# EasyEDA Pro project ProProject_20240809-UR5控制板_2024-08-29.epro

# Schematic Schematic1
Create Date: 2024-08-09; Page Name: P1; Project Name: 20240809-UR5控制板; Schematic Name: Schematic1; Update Date: 2024-08-09; Company: 嘉立创EDA; Page Size: A4; Version: V1.0
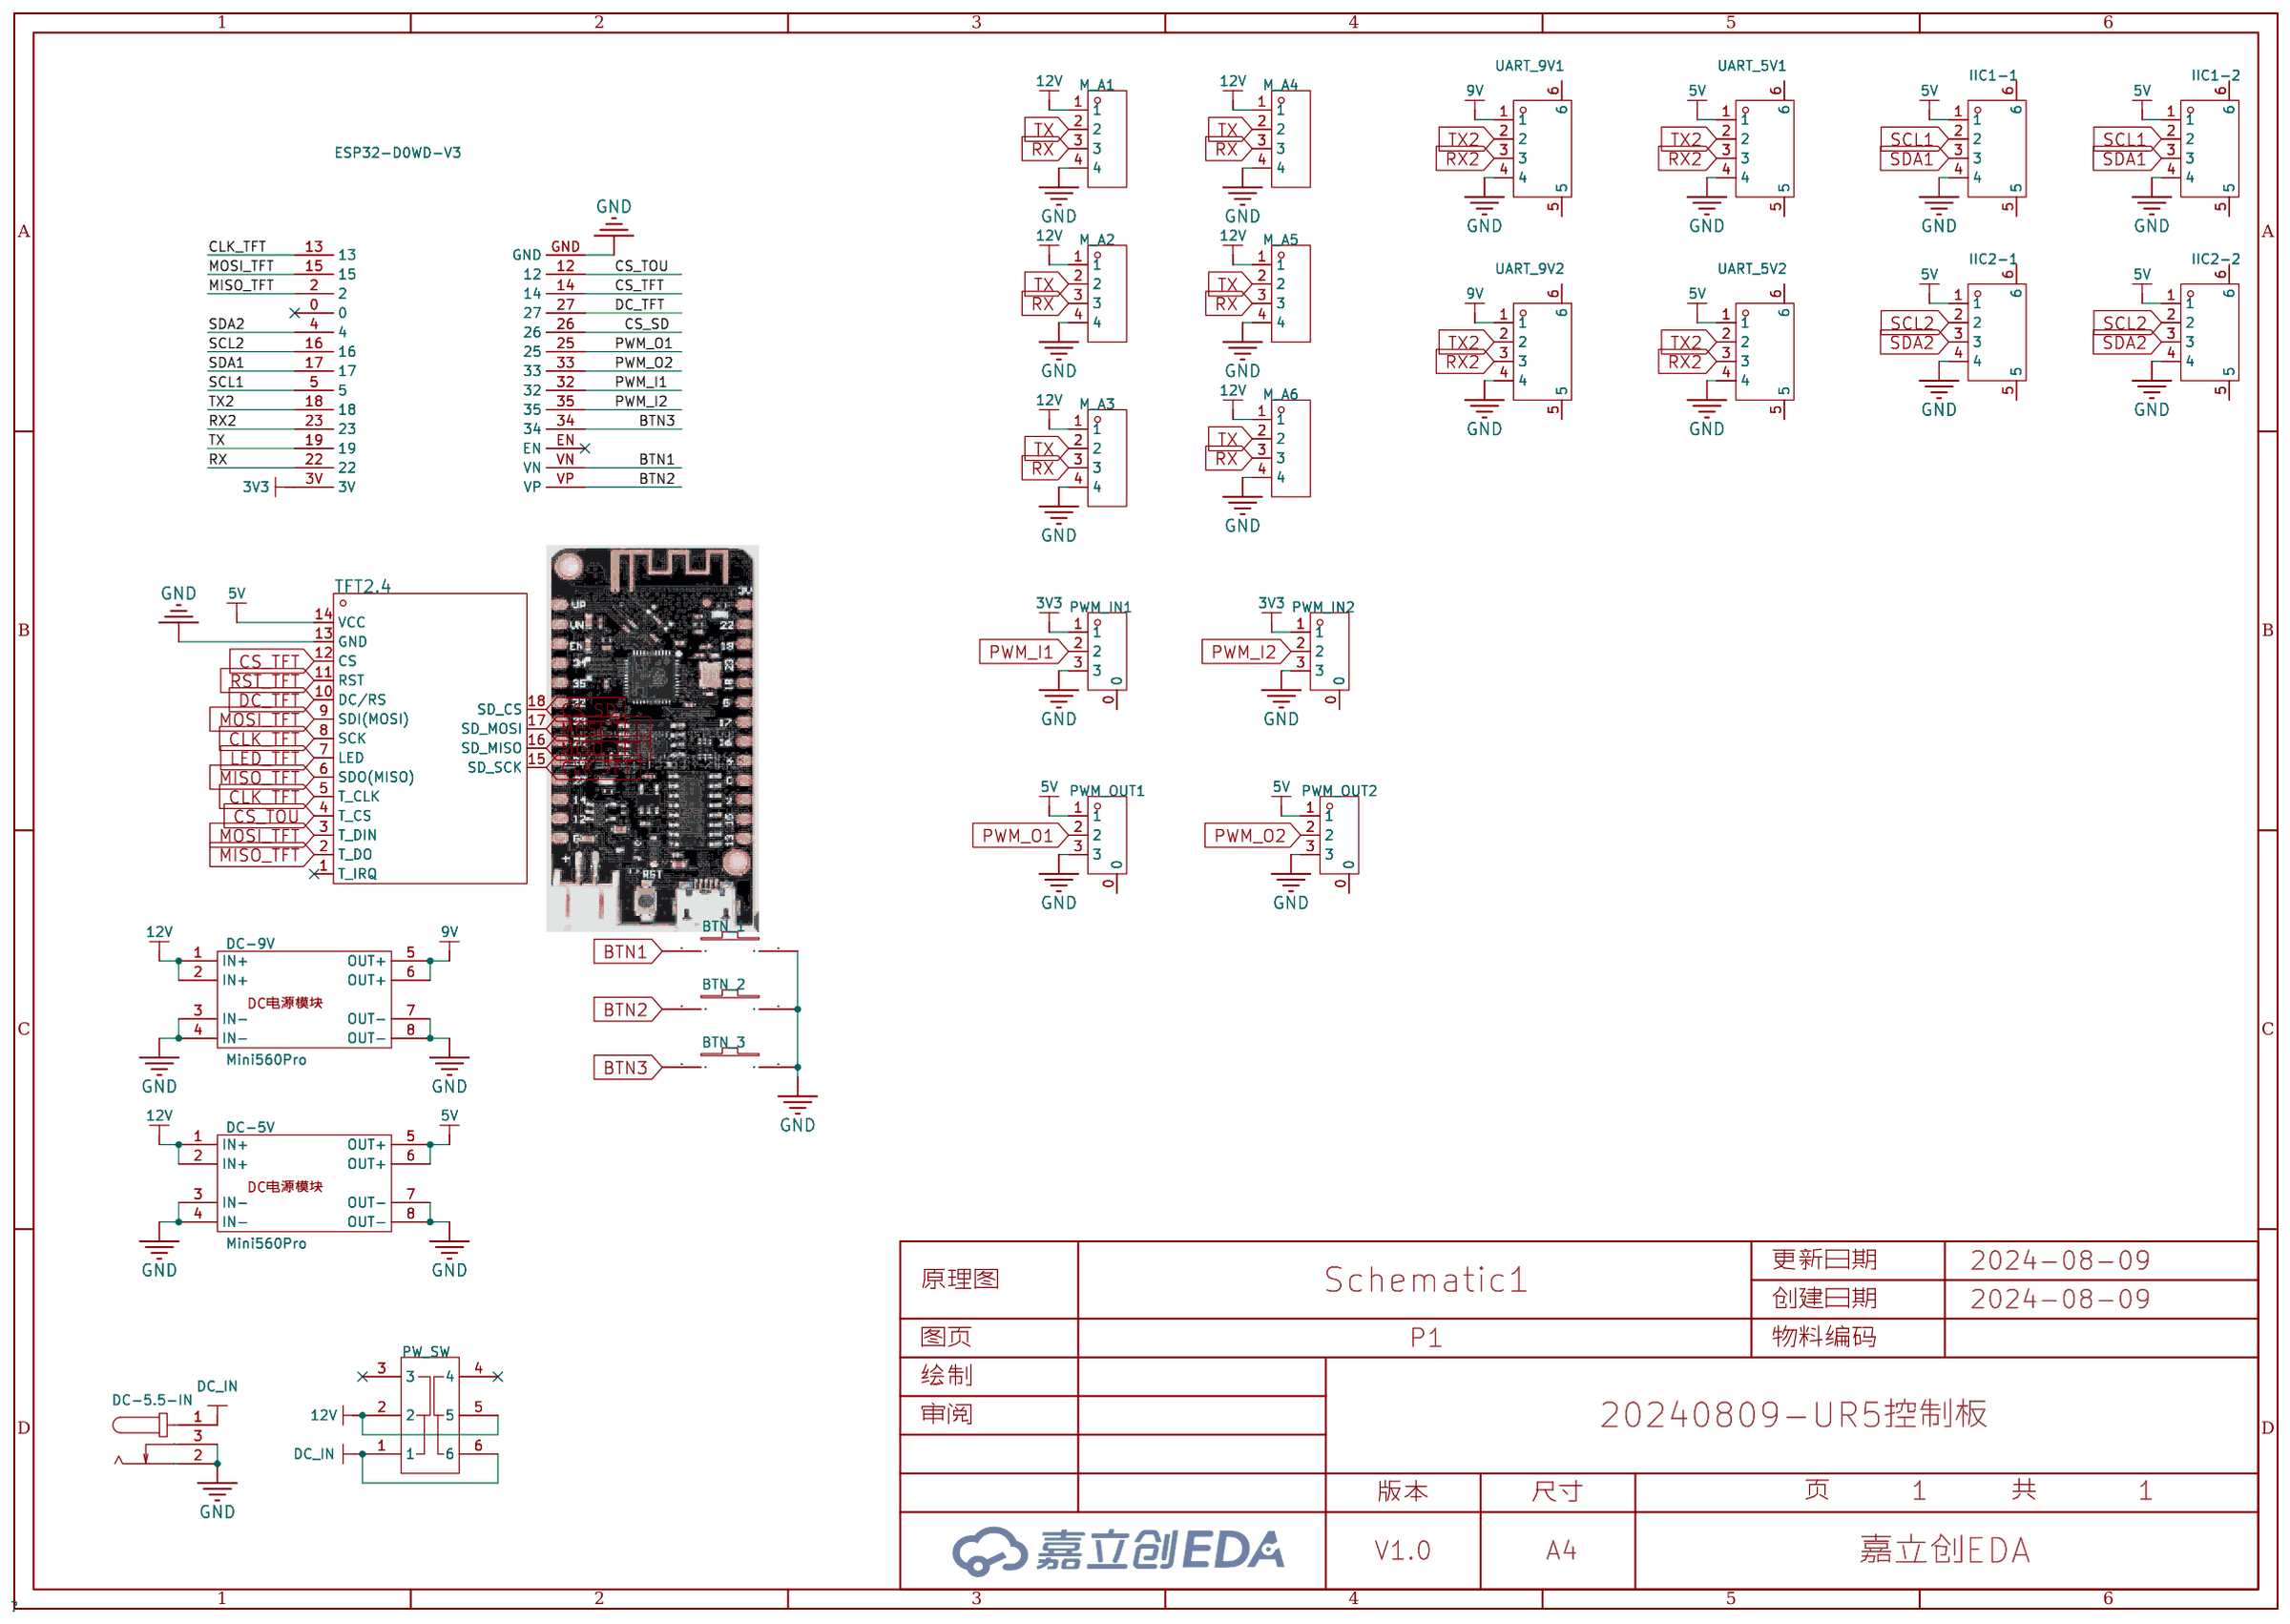
[diagram p0: schematic sheet]

## Parts
BTN_1  K2-1104DZ-B4SW-04  [SW-TH_2P-L6.2-W6.2-P5.0]
BTN_2  K2-1104DZ-B4SW-04  [SW-TH_2P-L6.2-W6.2-P5.0]
BTN_3  K2-1104DZ-B4SW-04  [SW-TH_2P-L6.2-W6.2-P5.0]
DC-5.5-IN  -  [DC母座]
DC-5V  Mini560Pro  [Mini560Pro]
DC-9V  Mini560Pro  [Mini560Pro]
ESP32-D0WD-V3  -  [ESP32]
IIC1-1  ZX-PH2.0-WT4P  [CONN-SMD_4P-P2.00_C2001RS10411M0101RC]
IIC1-2  ZX-PH2.0-WT4P  [CONN-SMD_4P-P2.00_C2001RS10411M0101RC]
IIC2-1  ZX-PH2.0-WT4P  [CONN-SMD_4P-P2.00_C2001RS10411M0101RC]
IIC2-2  ZX-PH2.0-WT4P  [CONN-SMD_4P-P2.00_C2001RS10411M0101RC]
M_A1  ZX-XH2.54-4PWZ  [CONN-TH_4P-P2.50_ZX-XH2.54-4PWZ]
M_A2  ZX-XH2.54-4PWZ  [CONN-TH_4P-P2.50_ZX-XH2.54-4PWZ]
M_A3  ZX-XH2.54-4PWZ  [CONN-TH_4P-P2.50_ZX-XH2.54-4PWZ]
M_A4  ZX-XH2.54-4PWZ  [CONN-TH_4P-P2.50_ZX-XH2.54-4PWZ]
M_A5  ZX-XH2.54-4PWZ  [CONN-TH_4P-P2.50_ZX-XH2.54-4PWZ]
M_A6  ZX-XH2.54-4PWZ  [CONN-TH_4P-P2.50_ZX-XH2.54-4PWZ]
PW_SW  开关-9*3.5  [SK09C G2]
PWM_IN1  SH1.0-3P  [CONN-SMD_3P-P1.00-L5.0-W5.0]
PWM_IN2  SH1.0-3P  [CONN-SMD_3P-P1.00-L5.0-W5.0]
PWM_OUT1  SH1.0-3P  [CONN-SMD_3P-P1.00-L5.0-W5.0]
PWM_OUT2  SH1.0-3P  [CONN-SMD_3P-P1.00-L5.0-W5.0]
TFT2.4  -  [TFT_2.4_18P_SPI_ILI9341_240X320_65K_S_1]
UART_5V1  ZX-PH2.0-WT4P  [CONN-SMD_4P-P2.00_C2001RS10411M0101RC]
UART_5V2  ZX-PH2.0-WT4P  [CONN-SMD_4P-P2.00_C2001RS10411M0101RC]
UART_9V1  ZX-PH2.0-WT4P  [CONN-SMD_4P-P2.00_C2001RS10411M0101RC]
UART_9V2  ZX-PH2.0-WT4P  [CONN-SMD_4P-P2.00_C2001RS10411M0101RC]

## Library data of the parts
BTN_1-BTN_3 = K2-1104DZ-B4SW-04: 作用力:250gf;安装方式:直插;开关长度:6mm;开关宽度:6mm;开关高度:4.5mm;触点电流:50mA;额定电压(DC):12V;绝缘电阻:100MΩ;机械寿命:10万次;; LCSC Part Name: 6x6x4.5  两脚插件开关; Supplier Part: C2690025; Manufacturer: 韩国韩荣; Supplier Footprint: 插件; JLCPCB Part Class: 扩展库; Datasheet: https://atta.szlcsc.com/upload/public/pdf/source/20201126/C961736_4F85C6E6E5B3656D5DC7C0B00D034F4A.pdf; Supplier: LCSC; Operating Force: 250gf; Mounting Style: 直插; Switch Length: 6mm; Switch Width: 6mm; Switch Height: 4.5mm; Contact Current: 50mA; Voltage Rating (DC): 12V; Insulation Resistance: 100MΩ; Mechanical Life: 10万次; Operating Temperature: -25℃~+85℃
DC-5.5-IN = DC母座
DC-5V DC-9V = Mini560Pro: DC电源模块; 购买链接: https://detail.tmall.com/item.htm?abbucket=10id=726771436106ns=1spm=a21n57.1.0.0.255a523cj9lO4QskuId=5046144793559
ESP32-D0WD-V3 = ESP32
IIC1-1 IIC1-2 IIC2-1 IIC2-2 UART_5V1 UART_5V2 UART_9V1 UART_9V2 = ZX-PH2.0-WT4P: 插针结构:1x4P;间距:2mm;安装方式:卧贴;参考系列:PH;总PIN数:4P;排数:1;每排PIN数:4;行距:-;额定电流:2A;触头材质:黄铜;触头镀层:锡;工作温度范围:-25℃~+85℃;; Supplier Part: C7429691; Manufacturer: Megastar(兆星); Supplier Footprint: SMD,P=2mm,卧贴; JLCPCB Part Class: 扩展库; Datasheet: https://atta.szlcsc.com/upload/public/pdf/source/20230619/C513FA7515D7082C4F95173A4D7F5060.pdf; Supplier: LCSC; Pins Structure: 1x4P; Pitch: 2mm; Mounting Style: 卧贴; Reference Series: PH; Number of Pins: 4P; Number of Rows: 1; Number of PINs Per Row: 4; Current Rating (Max): 2A; Contact Material: 黄铜; Contact Plating: 锡; Operating Temperature Range: -25℃~+85℃
M_A1-M_A6 = ZX-XH2.54-4PWZ: 插针结构:1x4P;间距:2.54mm;安装方式:弯插;参考系列:XH;总PIN数:4P;排数:1;每排PIN数:4;行距:-;额定电流:3A;触头材质:黄铜;触头镀层:锡;工作温度范围:-25℃~+85℃;; Supplier Part: C7429643; Manufacturer: Megastar(兆星); Supplier Footprint: 弯插,P=2.54mm; JLCPCB Part Class: 扩展库; Datasheet: https://atta.szlcsc.com/upload/public/pdf/source/20230619/8DC602C7BA46C153FF1BE89D90453879.pdf; Supplier: LCSC; Pins Structure: 1x4P; Pitch: 2.54mm; Mounting Style: 弯插; Reference Series: XH; Number of Pins: 4P; Number of Rows: 1; Number of PINs Per Row: 4; Current Rating (Max): 3A; Contact Material: 黄铜; Contact Plating: 锡; Operating Temperature Range: -25℃~+85℃
PW_SW = SK09C G2
PWM_IN1 PWM_IN2 PWM_OUT1 PWM_OUT2 = SH1.0-3P: Supplier Part: C9900019066; JLCPCB Part Class: 扩展库; Supplier: LCSC
TFT2.4 = TFT_2.4_18P_SPI_ILI9341_240X320_65K_S_1: 2.4寸SPI串口液晶屏TFT彩屏ILI9341驱动; _: 3

## Nets
3V3: ESP32-D0WD-V3.3V PWM_IN1.1 PWM_IN2.1
5V: DC-5V.5(OUT+) DC-5V.6(OUT+) IIC1-1.1 IIC1-2.1 IIC2-1.1 IIC2-2.1 PWM_OUT1.1 PWM_OUT2.1 TFT2.4.14(VCC) UART_5V1.1 UART_5V2.1
9V: DC-9V.5(OUT+) DC-9V.6(OUT+) UART_9V1.1 UART_9V2.1
12V: DC-5V.1(IN+) DC-5V.2(IN+) DC-9V.1(IN+) DC-9V.2(IN+) M_A1.1 M_A2.1 M_A3.1 M_A4.1 M_A5.1 M_A6.1 PW_SW.2 PW_SW.5
GND: BTN_1.2 BTN_2.2 BTN_3.2 DC-5.5-IN.2 DC-5.5-IN.3 DC-5V.3(IN-) DC-5V.4(IN-) DC-5V.7(OUT-) DC-5V.8(OUT-) DC-9V.3(IN-) DC-9V.4(IN-) DC-9V.7(OUT-) DC-9V.8(OUT-) ESP32-D0WD-V3.GND IIC1-1.4 IIC1-2.4 IIC2-1.4 IIC2-2.4 M_A1.4 M_A2.4 M_A3.4 M_A4.4 M_A5.4 M_A6.4 PWM_IN1.3 PWM_IN2.3 PWM_OUT1.3 PWM_OUT2.3 TFT2.4.13(GND) UART_5V1.4 UART_5V2.4 UART_9V1.4 UART_9V2.4
BTN1: BTN_1.1 ESP32-D0WD-V3.VN
BTN2: BTN_2.1 ESP32-D0WD-V3.VP
BTN3: BTN_3.1 ESP32-D0WD-V3.34
CLK_TFT: ESP32-D0WD-V3.13 TFT2.4.5(T_CLK) TFT2.4.8(SCK) TFT2.4.15(SD_SCK)
CS_SD: ESP32-D0WD-V3.26 TFT2.4.18(SD_CS)
CS_TFT: ESP32-D0WD-V3.14 TFT2.4.12(CS)
CS_TOU: ESP32-D0WD-V3.12 TFT2.4.4(T_CS)
DC_IN: DC-5.5-IN.1 PW_SW.1 PW_SW.6
DC_TFT: ESP32-D0WD-V3.27 TFT2.4.10(DC/RS)
LED_TFT: TFT2.4.7(LED)
MISO_TFT: ESP32-D0WD-V3.2 TFT2.4.2(T_DO) TFT2.4.6(SDO(MISO)) TFT2.4.16(SD_MISO)
MOSI_TFT: ESP32-D0WD-V3.15 TFT2.4.3(T_DIN) TFT2.4.9(SDI(MOSI)) TFT2.4.17(SD_MOSI)
PWM_I1: ESP32-D0WD-V3.32 PWM_IN1.2
PWM_I2: ESP32-D0WD-V3.35 PWM_IN2.2
PWM_O1: ESP32-D0WD-V3.25 PWM_OUT1.2
PWM_O2: ESP32-D0WD-V3.33 PWM_OUT2.2
RST_TFT: TFT2.4.11(RST)
RX: ESP32-D0WD-V3.22 M_A1.3 M_A2.3 M_A3.3 M_A4.3 M_A5.3 M_A6.3
RX2: ESP32-D0WD-V3.23 UART_5V1.3 UART_5V2.3 UART_9V1.3 UART_9V2.3
SCL1: ESP32-D0WD-V3.5 IIC1-1.2 IIC1-2.2
SCL2: ESP32-D0WD-V3.16 IIC2-1.2 IIC2-2.2
SDA1: ESP32-D0WD-V3.17 IIC1-1.3 IIC1-2.3
SDA2: ESP32-D0WD-V3.4 IIC2-1.3 IIC2-2.3
TX: ESP32-D0WD-V3.19 M_A1.2 M_A2.2 M_A3.2 M_A4.2 M_A5.2 M_A6.2
TX2: ESP32-D0WD-V3.18 UART_5V1.2 UART_5V2.2 UART_9V1.2 UART_9V2.2

Not connected (* = marked no-connect by the designer): ESP32-D0WD-V3 0* EN*; IIC1-1 5 6; IIC1-2 5 6; IIC2-1 5 6; IIC2-2 5 6; PW_SW 3* 4*; PWM_IN1 0; PWM_IN2 0; PWM_OUT1 0; PWM_OUT2 0; TFT2.4 1(T_IRQ)*; UART_5V1 5 6; UART_5V2 5 6; UART_9V1 5 6; UART_9V2 5 6

# Board PCB1
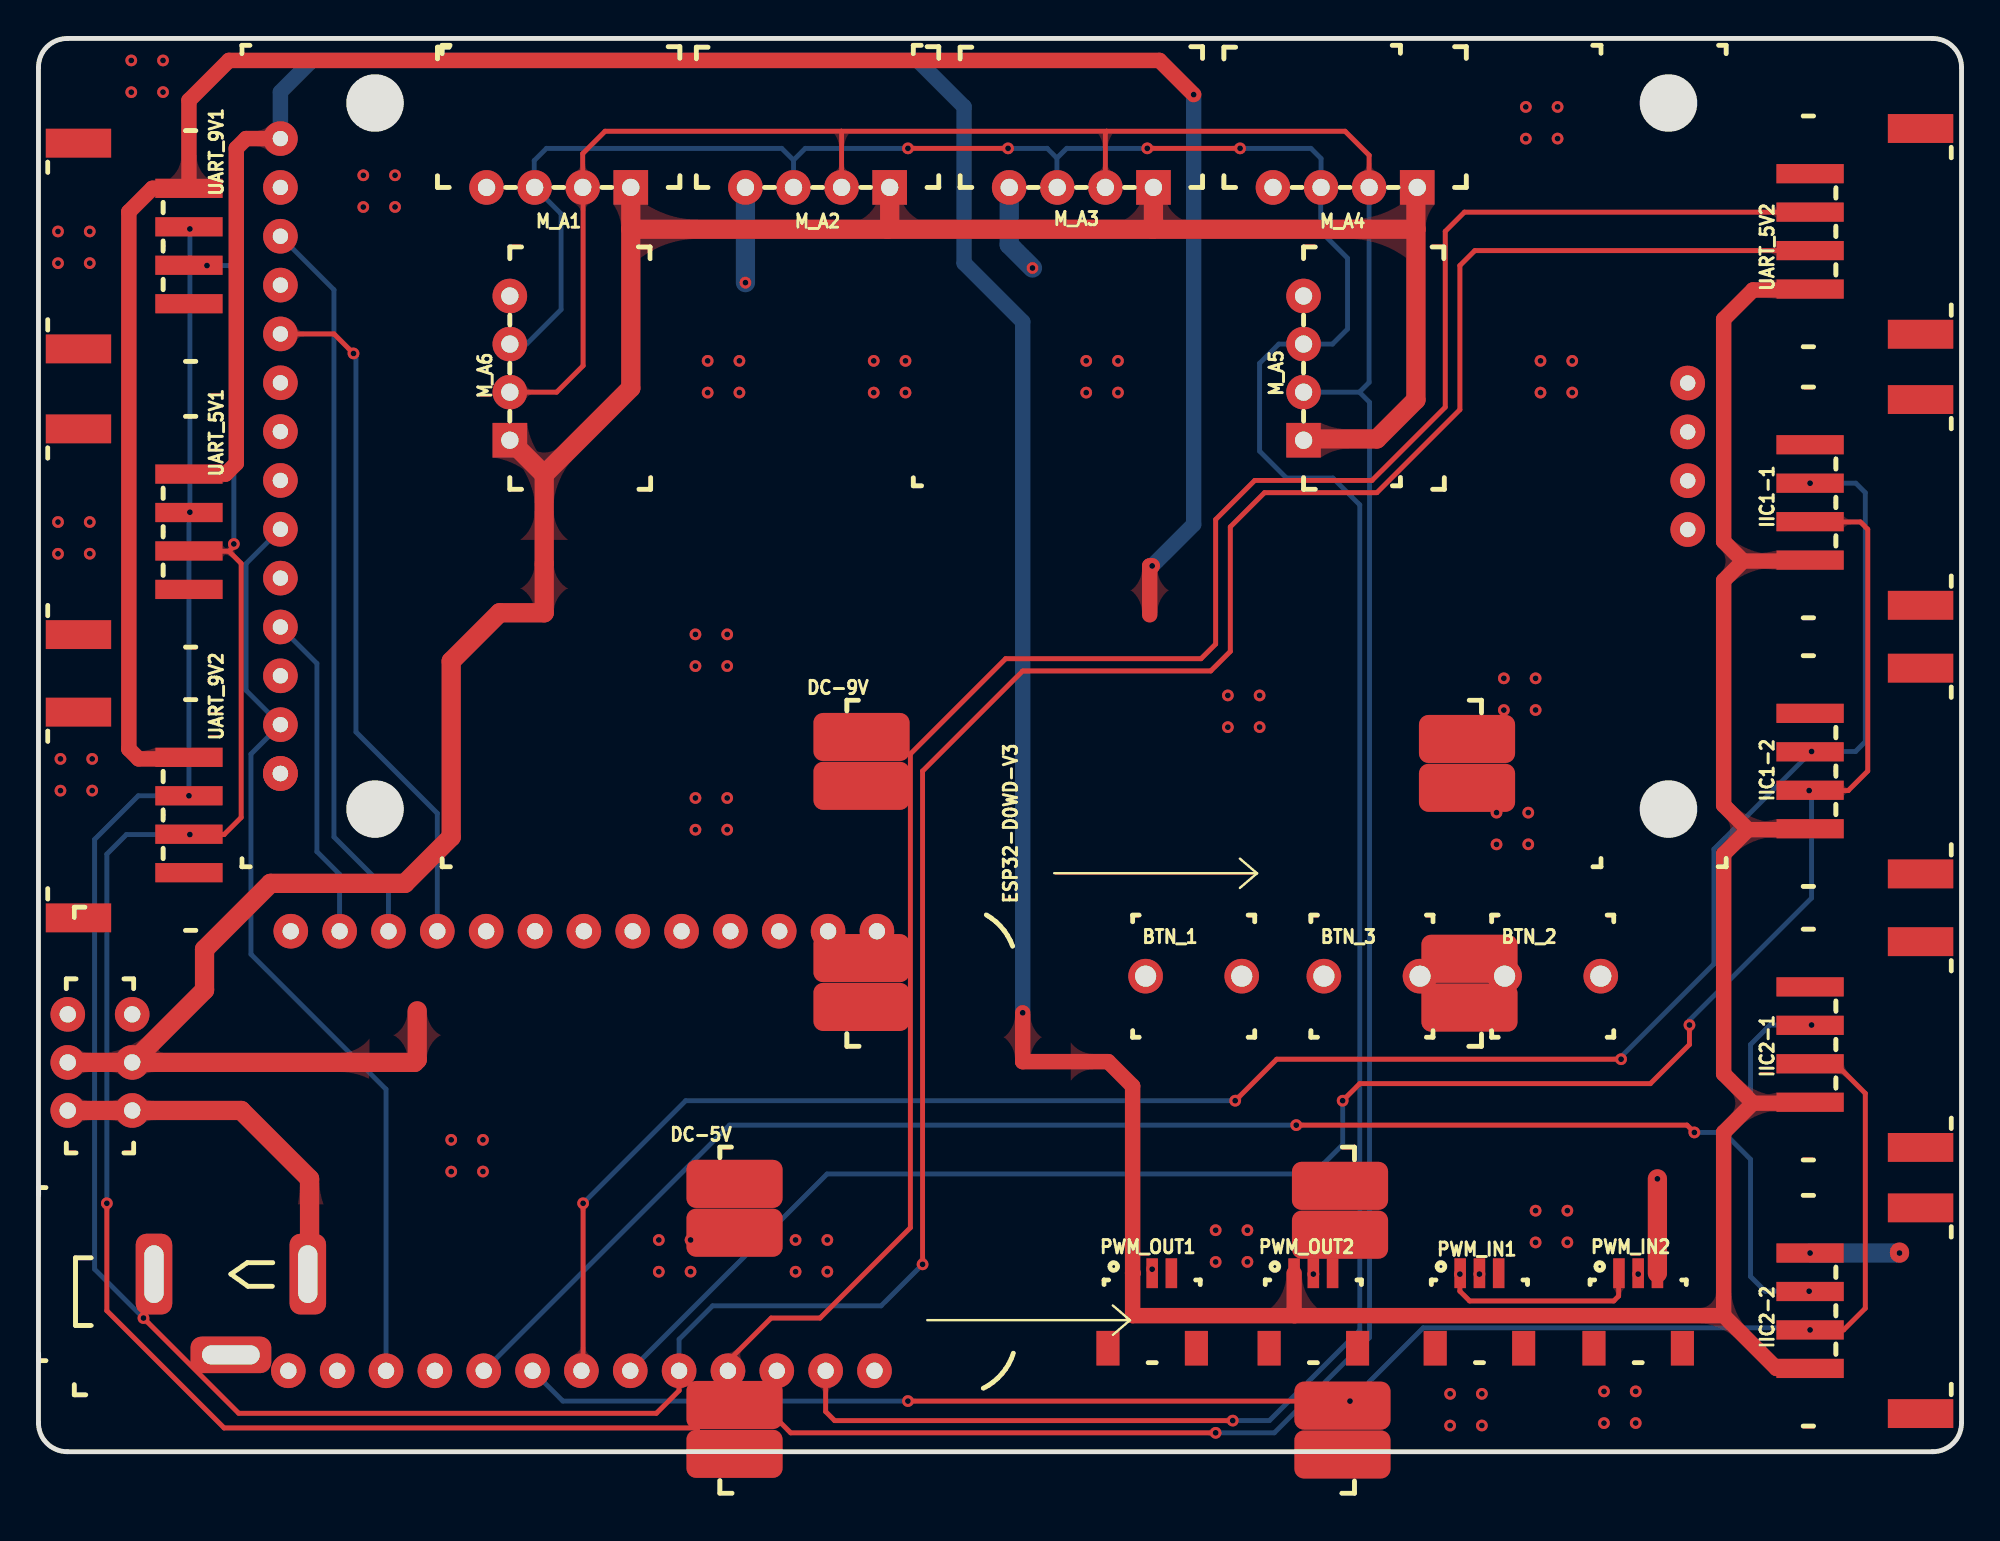
[diagram p1: board, top side]
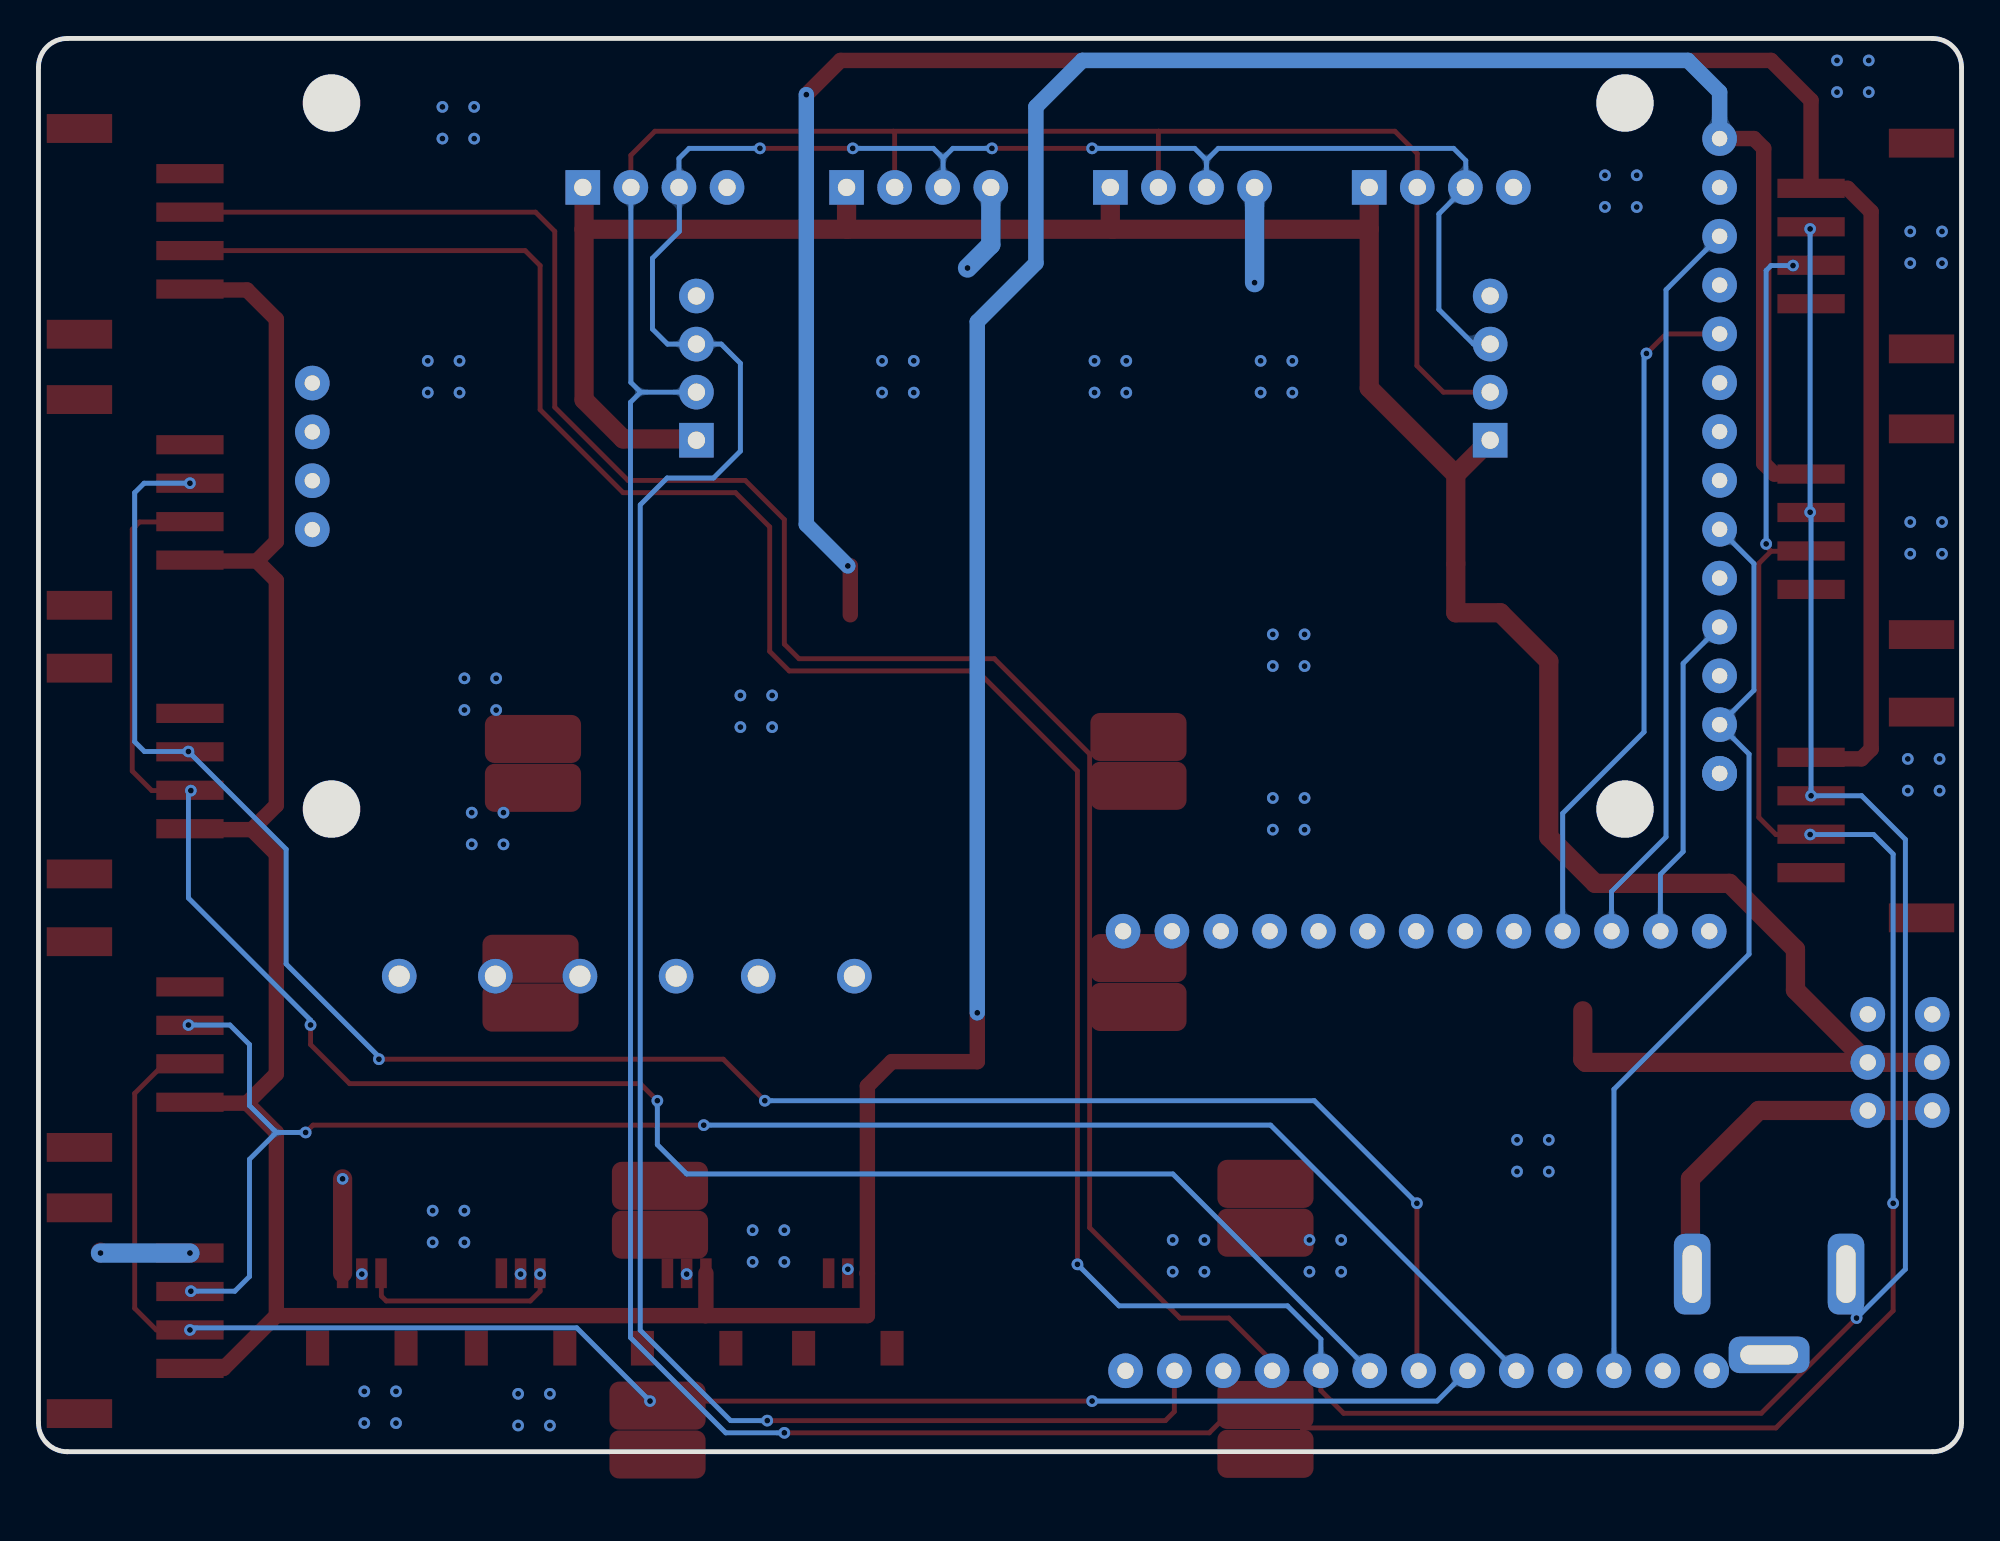
[diagram p2: board, bottom side, seen from below]

Outline 100 x 73.5 mm; copper layers: Top Layer, Inner1, Inner2, Bottom Layer. Coordinates in mm from the lower left corner of the outline.
Outline path: 0,72 0,1.5 arc(0.44,0.44) 1.5,0 98.5,0 arc(99.56,0.44) 100,1.5 100,72 arc(99.56,73.06) 98.5,73.5 1.5,73.5 arc(0.44,73.06) 0,72
Stack: Top Layer 0.035mm 外层铜厚1oz / Dielectric1 0.2104mm 7628 RC49% 8.6mil / Inner1 0.0152mm 内层铜厚 / Dielectric2 1.065mm 1.1mm H/HOZ 含铜 / Inner2 0.0152mm 内层铜厚 / Dielectric3 0.2104mm 7628 RC49% 8.6mil / Bottom Layer 0.035mm 外层铜厚1oz

## Design rules (mm)
template: JLCPCB Capability(Two Layers Board)
spacing copperThickness1oz (default): track to track 0.102, other pairs 0.152 to 0.3
spacing copperThickness2oz: track to track 0.203, other pairs 0.152 to 0.3
track width copperThickness1oz (default): min 0.127, default 0.254, max 2.54
track width copperThickness2oz: min 0.203, default 0.254, max 2.54
differential pair differentialPair (default): width min 0.127, default 0.254, max 2.54; gap min 0.152, default 0.152
via viaSize (default): diameter min 0.5, default 0.61, max 10; hole min 0.3, default 0.305, max 6.3

## Placement (name value [footprint] x y rotation side)
BTN_1  K2-1104DZ-B4SW-04  [SW-TH_2P-L6.2-W6.2-P5.0]  60.07 24.73 0 top
BTN_2  K2-1104DZ-B4SW-04  [SW-TH_2P-L6.2-W6.2-P5.0]  78.74 24.73 0 top
BTN_3  K2-1104DZ-B4SW-04  [SW-TH_2P-L6.2-W6.2-P5.0]  69.34 24.73 0 top
DC-5.5-IN  -  [DC母座]  10.16 10.76 90 top
DC-5V  -  [Mini560Pro]  35.43 15.84 0 top
DC-9V  -  [Mini560Pro]  42.04 39.08 0 top
ESP32-D0WD-V3  -  [ESP32]  24.38 15.72 270 top
IIC1-1  ZX-PH2.0-WT4P  [CONN-SMD_4P-P2.00_C2001RS10411M0101RC]  95 49.37 90 top
IIC1-2  ZX-PH2.0-WT4P  [CONN-SMD_4P-P2.00_C2001RS10411M0101RC]  95 35.4 90 top
IIC2-1  ZX-PH2.0-WT4P  [CONN-SMD_4P-P2.00_C2001RS10411M0101RC]  95 21.18 90 top
IIC2-2  ZX-PH2.0-WT4P  [CONN-SMD_4P-P2.00_C2001RS10411M0101RC]  95 7.33 90 top
M_A1  ZX-XH2.54-4PWZ  [CONN-TH_4P-P2.50_ZX-XH2.54-4PWZ]  27.05 65.75 180 top
M_A2  ZX-XH2.54-4PWZ  [CONN-TH_4P-P2.50_ZX-XH2.54-4PWZ]  40.51 65.75 180 top
M_A3  ZX-XH2.54-4PWZ  [CONN-TH_4P-P2.50_ZX-XH2.54-4PWZ]  54.23 65.75 180 top
M_A4  ZX-XH2.54-4PWZ  [CONN-TH_4P-P2.50_ZX-XH2.54-4PWZ]  67.94 65.75 180 top
M_A5  ZX-XH2.54-4PWZ  [CONN-TH_4P-P2.50_ZX-XH2.54-4PWZ]  65.79 56.36 90 top
M_A6  ZX-XH2.54-4PWZ  [CONN-TH_4P-P2.50_ZX-XH2.54-4PWZ]  24.51 56.36 90 top
PW_SW  开关-9*3.5  [SK09C G2]  1.52 17.75 90 top
PWM_IN1  SH1.0-3P  [CONN-SMD_3P-P1.00-L5.0-W5.0]  74.93 7.33 0 top
PWM_IN2  SH1.0-3P  [CONN-SMD_3P-P1.00-L5.0-W5.0]  83.19 7.33 0 top
PWM_OUT1  SH1.0-3P  [CONN-SMD_3P-P1.00-L5.0-W5.0]  57.91 7.33 0 top
PWM_OUT2  SH1.0-3P  [CONN-SMD_3P-P1.00-L5.0-W5.0]  66.29 7.33 0 top
TFT2.4  -  [TFT_2.4_18P_SPI_ILI9341_240X320_65K_S_1]  39.75 51.28 270 top
UART_5V1  ZX-PH2.0-WT4P  [CONN-SMD_4P-P2.00_C2001RS10411M0101RC]  4.95 47.85 270 top
UART_5V2  ZX-PH2.0-WT4P  [CONN-SMD_4P-P2.00_C2001RS10411M0101RC]  95 63.47 90 top
UART_9V1  ZX-PH2.0-WT4P  [CONN-SMD_4P-P2.00_C2001RS10411M0101RC]  4.95 62.7 270 top
UART_9V2  ZX-PH2.0-WT4P  [CONN-SMD_4P-P2.00_C2001RS10411M0101RC]  4.95 33.11 270 top

## Footprints (pads in the part's own frame, mm; a bottom-side part is the same pattern mirrored in y, then rotated)
CONN-SMD_3P-P1.00-L5.0-W5.0
  rect 1.2x1.8 smd: 0(-2.3,-1.95) 0(2.3,-1.95)
  rect 0.6x1.55 smd: 1(-1,1.95) 2(0,1.95) 3(1,1.95)
CONN-SMD_4P-P2.00_C2001RS10411M0101RC
  rect 1x3.5 smd: 1(-3,2.873) 2(-1,2.873) 3(1,2.873) 4(3,2.873)
  rect 1.5x3.4 smd: 5(-5.35,-2.873) 6(5.35,-2.873)
CONN-TH_4P-P2.50_ZX-XH2.54-4PWZ
  rect 1.8x1.8 hole 0.9x0.85: 1(-3.75,0)
  round 1.8 hole 0.9x0.85: 2(-1.25,0) 3(1.25,0) 4(3.75,0)
DC母座
  rrect 4.2x1.9 hole 3x1: 1(-1.525,-3.847) 3(-1.525,4.153)
  rrect 1.9x4.2 hole 1x3: 2(-5.725,0.153)
ESP32
  round 1.8 hole 0.85: 0(11.505,-3.771) 2(11.505,-6.311) 3V(11.505,19.09) 4(11.505,-1.23) 5(11.505,6.389) 12(-11.354,-8.723) 13(11.505,-11.39) 14(-11.354,-6.184) 15(11.505,-8.851) 16(11.505,1.31) 17(11.505,3.849) 18(11.505,8.93) 19(11.505,14.009) 22(11.505,16.549) 23(11.505,11.47) 25(-11.354,1.437) 26(-11.354,-1.103) 27(-11.354,-3.643) 32(-11.354,6.516) 33(-11.354,3.977) 34(-11.354,11.597) 35(-11.354,9.056) EN(-11.354,14.136) GND(-11.354,-11.264) VN(-11.354,16.677) VP(-11.354,19.216)
Mini560Pro
  rrect 5x2.5 smd: 1(0.762,-1.911) 2(0.762,-4.452) 3(0.762,-13.412) 4(0.762,-15.951) 5(32.248,-2.015) 6(32.248,-4.555) 7(32.375,-13.445) 8(32.375,-15.985)
SK09C G2
  round 1.8 hole 0.85: 1(0,0) 2(2.5,0) 3(5,0) 4(5,-3.35) 5(2.5,-3.35) 6(0,-3.35)
SW-TH_2P-L6.2-W6.2-P5.0
  round 1.8 hole 1.1x0.85: 1(-2.5,0) 2(2.5,0)
TFT_2.4_18P_SPI_ILI9341_240X320_65K_S_1
  round 1.8 hole 0.8: 1(16.002,-27.17) 1(16.002,-27.17) 2(13.462,-27.17) 3(10.922,-27.17) 4(8.382,-27.17) 5(5.842,-27.17) 6(3.302,-27.17) 7(0.762,-27.17) 8(-1.778,-27.17) 9(-4.318,-27.17) 10(-6.858,-27.17) 11(-9.398,-27.17) 12(-11.938,-27.17) 13(-14.478,-27.17) 14(-17.018,-27.17) 15(3.316,46.01) 16(0.776,46.01) 17(-1.764,46.01) 18(-4.304,46.01)

## Nets
As in the schematic.

Pads without a net: ESP32-D0WD-V3 0 EN; IIC1-1 5 6; IIC1-2 5 6; IIC2-1 5 6; IIC2-2 5 6; PW_SW 3 4; PWM_IN1 0; PWM_IN2 0; PWM_OUT1 0; PWM_OUT2 0; TFT2.4 1; UART_5V1 5 6; UART_5V2 5 6; UART_9V1 5 6; UART_9V2 5 6

## Via types
v1: diameter 0.61, hole 0.305, Top Layer to Bottom Layer, 132 vias

## Routing (per net, layer and track width the routed paths; a pad name or vN(x,y) marks a point on that pad's centre or on a via; arc(x,y) is an arc through that point)
3V3: length 43.2
  Top Layer w0.254: PWM_IN1.1 73.91,9.27 v1(73.91,9.24) 73.91,8.35 74.42,7.84 81.91,7.84 82.17,8.09 82.17,9.27 PWM_IN2.1
  Inner1 w0.254: v1(73.91,9.24) 73.53,9.24 68.5,4.21 ESP32-D0WD-V3.3V
5V: length 238.8
  Top Layer w0.8: 89.15,18.13 87.63,16.6 87.63,7.08 ; 89.15,18.13 92.08,18.13 IIC2-1.1 ; 89.15,18.13 87.63,19.65 87.63,31.08 88.9,32.35 ; TFT2.4.14 10.8,68.29 10.29,67.78 10.29,51.4 9.73,50.85 UART_5V1.1 ; 88.65,46.32 92.08,46.32 IIC1-1.1 ; 88.65,46.32 87.63,47.34 87.63,58.89 89.15,60.42 92.08,60.42 UART_5V2.1 ; 88.65,46.32 87.63,45.31 87.63,33.62 88.9,32.35 ; IIC1-2.1 92.08,32.35 88.9,32.35 ; IIC2-2.1 90.38,4.33 87.63,7.08 ; 87.63,7.08 65.31,7.08 ; 65.31,7.08 56.9,7.08 56.9,9.27 PWM_OUT1.1 56.9,9.3 56.9,19.02 55.63,20.29 51.18,20.29 v1(51.18,22.83) ; 65.31,7.08 65.29,7.1 PWM_OUT2.1
  Bottom Layer w0.8: v1(51.18,22.83) 51.18,58.77 48.13,61.82 48.13,69.94 45.72,72.36 14.22,72.36 12.58,70.71 TFT2.4.14
9V: length 121.6
  Top Layer w0.8: UART_9V2.1 7.75,36.03 5.21,36.03 4.7,36.54 4.7,64.48 5.92,65.7 UART_9V1.1 7.83,70.28 9.91,72.36 58.29,72.36 v1(60.07,70.58) ; 57.78,45.94 v1(57.91,46.07) 57.78,46.07 57.78,45.94 ; 57.78,45.94 57.78,43.53
  Bottom Layer w0.8: v1(57.91,46.07) 60.07,48.23 v1(60.07,70.58)
12V: length 148
  Top Layer w1: 57.95,63.58 71.63,63.58 ; 57.95,63.58 44.15,63.58 ; 57.95,63.58 57.98,63.61 M_A3.1 ; 71.63,63.58 71.63,54.7 69.6,52.67 65.85,52.67 M_A5.1 ; 71.63,63.58 71.63,65.69 M_A4.1 ; 26.3,50.82 30.8,55.32 30.8,63.58 ; 26.3,50.82 M_A6.1 ; 26.3,50.82 26.3,43.63 23.98,43.63 21.46,41.11 21.46,31.97 19.05,29.56 12.06,29.56 8.64,26.13 8.64,24.01 PW_SW.5 ; 19.69,22.93 19.69,20.39 19.55,20.25 PW_SW.5 ; M_A2.1 44.26,63.69 44.15,63.58 ; PW_SW.5 PW_SW.2 ; 30.8,63.58 M_A1.1 ; 30.8,63.58 44.15,63.58
GND: length 19.3
  Top Layer w1: v1(96.77,10.33) 96.77,10.38 ; PWM_IN2.3 v1(84.19,14.19)
  Bottom Layer w1: M_A2.4 v1(36.76,60.8) ; v1(92.12,10.33) v1(96.77,10.33) ; v1(51.69,61.56) 50.48,62.77 M_A3.4
  vias: v1(1.02,63.46) v1(1.02,61.81) v1(1.02,48.35) v1(1.02,46.7) v1(1.14,36.03) v1(1.14,34.38) v1(2.67,63.46) v1(2.67,61.82) v1(2.67,48.35) v1(2.67,46.7) v1(2.79,36.03) v1(2.79,34.38) v1(4.83,72.36) v1(4.83,70.71) v1(6.48,72.36) v1(6.48,70.71) v1(16.89,66.38) v1(16.89,64.73) v1(18.54,66.38) v1(18.54,64.74) v1(21.46,16.22) v1(21.46,14.57) v1(23.11,16.22) v1(23.11,14.57) v1(32.26,11.01) v1(32.26,9.36) v1(33.91,11.01) v1(33.91,9.37) v1(34.16,42.51) v1(34.16,40.86) v1(34.16,34) v1(34.16,32.35) v1(34.8,56.73) v1(34.8,55.08) v1(35.81,42.51) v1(35.81,40.86) v1(35.81,34) v1(35.81,32.35) v1(36.45,56.73) v1(36.45,55.08) v1(39.37,11.01) v1(39.37,9.36) v1(41.02,11.01) v1(41.02,9.37) v1(43.43,56.73) v1(43.43,55.08) v1(45.09,56.73) v1(45.09,55.08) v1(54.48,56.73) v1(54.48,55.08) v1(56.13,56.73) v1(56.13,55.08) v1(61.21,11.52) v1(61.21,9.87) v1(61.85,39.33) v1(61.85,37.68) v1(62.87,11.52) v1(62.87,9.87) v1(63.5,39.33) v1(63.5,37.69) v1(73.41,3.01) v1(73.41,1.36) v1(75.06,3.01) v1(75.06,1.36) v1(75.82,33.24) v1(75.82,31.59) v1(76.2,40.22) v1(76.2,38.57) v1(77.34,69.94) v1(77.34,68.29) v1(77.47,33.24) v1(77.47,31.59) v1(77.85,40.22) v1(77.85,38.58) v1(77.85,12.54) v1(77.85,10.89) v1(78.1,56.73) v1(78.1,55.08) v1(78.99,69.94) v1(78.99,68.29) v1(79.5,12.54) v1(79.5,10.89) v1(79.76,56.73) v1(79.76,55.08) v1(81.41,3.14) v1(81.41,1.49) v1(83.06,3.14) v1(83.06,1.49)
BTN1: length 21.2
  Inner1 w0.254: BTN_1.1 57.53,24.77 57.53,27.78 55.88,29.43 43.42,29.43 ESP32-D0WD-V3.VN
BTN2: length 36.7
  Inner1 w0.254: BTN_2.1 76.24,23.76 74.17,21.68 57.28,21.68 51.89,27.07 ESP32-D0WD-V3.VP
BTN3: length 35.6
  Inner2 w0.254: BTN_3.1 66.84,24.26 63.12,20.54 42.51,20.54 ESP32-D0WD-V3.34
CLK_TFT: length 128.8
  Inner1 w0.254: 12.58,53.05 11.05,51.52 11.05,46.97 TFT2.4.5 10.29,43.14 10.29,24.99 15.88,19.4 15.88,7.09 ESP32-D0WD-V3.13
  Inner2 w0.254: TFT2.4.5 14.36,47.21 85.01,47.21 TFT2.4.15
CS_SD: length 94
  Inner2 w0.254: TFT2.4.18 88.52,52.82 88.52,47.34 87.25,46.07 82.55,46.07 81.91,46.7 25.15,46.7 23.28,44.84 ESP32-D0WD-V3.26
CS_TFT: length 38.5
  Bottom Layer w0.254: ESP32-D0WD-V3.14 18.2,29.14 15.37,31.97 15.37,60.43 12.58,63.21
CS_TOU: length 17.1
  Bottom Layer w0.254: TFT2.4.4 14.48,41 14.48,31.21 15.66,30.03 ESP32-D0WD-V3.12
DC_IN: length 17.5
  Top Layer w1: 14.16,10.76 14.1,10.82 14.1,14.19 10.54,17.75 PW_SW.6 PW_SW.1
DC_TFT: length 36.1
  Top Layer w0.254: v1(16.38,57.12) 15.37,58.13 12.58,58.13
  Bottom Layer w0.254: ESP32-D0WD-V3.27 20.74,33.2 16.51,37.43 16.51,56.99 v1(16.38,57.12)
MISO_TFT: length 123
  Inner2 w0.254: TFT2.4.16 85.65,50.39 83.06,50.39 80.65,47.97 TFT2.4.6
  Bottom Layer w0.254: TFT2.4.6 10.8,46.19 10.8,39.6 TFT2.4.2 11.05,36.28 11.05,25.88 18.07,18.85 ESP32-D0WD-V3.2
MOSI_TFT: length 133.7
  Inner2 w0.254: ESP32-D0WD-V3.15 16.38,5.06 16.38,20.29 10.92,25.75 10.92,38.69 12.58,40.35 11.05,41.89 11.05,54.06 TFT2.4.9 15.49,55.59 22.22,48.86 77.98,48.86 82.16,53.04 TFT2.4.17
PWM_I1: length 52.4
  Top Layer w0.254: v1(74.93,9.24) PWM_IN1.2
  Inner2 w0.254: ESP32-D0WD-V3.32 43.91,14.06 71.63,14.06 74.93,10.76 v1(74.93,9.24)
PWM_I2: length 58.7
  Top Layer w0.254: v1(83.19,9.24) PWM_IN2.2
  Inner2 w0.254: v1(83.19,9.24) 83.19,11.91 80.14,14.95 45.56,14.95 ESP32-D0WD-V3.35
PWM_O1: length 40.7
  Top Layer w0.254: v1(57.91,9.49) PWM_OUT1.2
  Inner2 w0.254: ESP32-D0WD-V3.25 39.84,13.05 56.26,13.05 57.91,11.4 v1(57.91,9.49)
PWM_O2: length 46.9
  Top Layer w0.254: v1(66.29,9.24) PWM_OUT2.2
  Inner2 w0.254: ESP32-D0WD-V3.33 41.87,13.56 64.52,13.56 66.29,11.78 v1(66.29,9.24)
RX: length 157.7
  Top Layer w0.254: v1(62.1,1.62) 41.4,1.62 40.93,2.09 ESP32-D0WD-V3.22 ; v1(62.48,67.78) v1(57.66,67.78) ; v1(50.42,67.78) v1(45.21,67.78)
  Bottom Layer w0.254: v1(62.48,67.78) 66.17,67.78 66.69,67.26 M_A4.3 66.68,65.73 66.68,63.47 68.07,62.07 68.07,58.39 67.29,57.61 M_A5.3 64.5,57.61 63.5,56.61 63.5,52.04 64.9,50.64 67.31,50.64 68.71,49.24 68.71,6.32 64.01,1.62 v1(62.1,1.62) ; v1(50.42,67.78) 52.45,67.78 52.96,67.28 ; 39.26,67.17 38.65,67.78 26.42,67.78 25.78,67.15 25.78,65.77 M_A1.3 27.18,64.38 27.18,59.4 25.38,57.61 M_A6.3 ; 39.26,67.17 39.88,67.78 v1(45.21,67.78) ; 39.26,67.17 M_A2.3 ; 52.96,67.28 53.47,67.78 v1(57.66,67.78) ; 52.96,67.28 52.96,65.77 M_A3.3
RX2: length 206.9
  Top Layer w0.254: UART_9V1.3 7.84,61.69 v1(8.76,61.69) ; 9.91,46.83 7.84,46.83 UART_5V1.3 ; 9.91,46.83 10.54,46.19 10.54,32.99 9.65,32.1 v1(7.87,32.1) 7.86,32.11 UART_9V2.3 ; 9.91,46.83 10.16,47.08 v1(10.16,47.21) ; v1(3.56,12.92) 3.56,7.33 9.65,1.24 34.29,1.24 35.85,2.8 ESP32-D0WD-V3.23 35.85,4.71 38.1,6.95 40.64,6.95 45.34,11.65 45.34,36.29 50.29,41.24 60.45,41.24 61.21,42 61.21,48.48 63.25,50.51 69.34,50.51 73.15,54.32 73.15,63.47 74.15,64.47 UART_5V2.3
  Bottom Layer w0.254: v1(8.76,61.69) 9.91,61.69 10.16,61.44 v1(10.16,47.21) ; v1(7.87,32.1) 4.57,32.1 3.56,31.08 v1(3.56,12.92)
SCL1: length 98.6
  Top Layer w0.254: v1(85.85,22.19) 85.85,21.18 83.82,19.14 68.71,19.14 v1(67.82,18.25) ; 92.11,34.38 94.11,34.38 95.12,35.4 95.12,47.97 94.74,48.35 92.14,48.35 IIC1-1.2 ; 92.11,34.38 v1(92.07,34.38) ; 92.11,34.38 IIC1-2.2
  Bottom Layer w0.254: v1(67.82,18.25) 67.82,15.97 66.29,14.44 41.01,14.44 ESP32-D0WD-V3.5 ; v1(92.07,34.38) 92.2,34.26 92.2,28.8 85.85,22.45 v1(85.85,22.19)
SCL2: length 86.8
  Top Layer w0.254: v1(92.12,6.33) 93.87,6.33 95,7.46 95,18.64 93.46,20.18 IIC2-1.2 ; v1(68.2,2.63) v1(45.21,2.63)
  Bottom Layer w0.254: ESP32-D0WD-V3.16 27.27,2.63 v1(45.21,2.63) ; v1(68.2,2.63) 72.01,6.44 92.12,6.44 v1(92.12,6.33)
SDA1: length 105.1
  Top Layer w0.254: IIC1-2.3 92.14,36.42 v1(92.2,36.42) ; v1(82.3,20.41) 64.39,20.41 v1(62.23,18.25) ; ESP32-D0WD-V3.17 28.32,4.3 v1(28.32,12.92)
  Bottom Layer w0.254: v1(82.3,20.41) 82.3,20.54 87.12,25.37 87.12,31.34 v1(92.2,36.42) 94.49,36.42 95,36.92 95,49.88 94.5,50.37 v1(92.12,50.37) ; v1(62.23,18.25) 33.66,18.25 v1(28.32,12.92)
SDA2: length 90.2
  Top Layer w0.254: v1(92.07,8.35) 92.11,8.35 IIC2-2.3 ; IIC2-1.3 92.19,22.18 v1(92.2,22.19) ; v1(86.11,16.6) 85.72,16.98 v1(65.41,16.98)
  Bottom Layer w0.254: v1(92.2,22.19) 90.04,22.19 89.03,21.18 89.03,18 87.63,16.6 ; ESP32-D0WD-V3.4 35.93,16.98 v1(65.41,16.98) ; v1(86.11,16.6) 87.63,16.6 ; 87.63,16.6 89.03,15.21 89.03,9.11 89.79,8.35 v1(92.07,8.35)
TX: length 163.7
  Top Layer w0.254: 55.55,68.67 41.75,68.67 ; 55.55,68.67 55.48,68.61 M_A3.2 ; 55.55,68.67 67.94,68.67 69.19,67.42 M_A4.2 ; 41.75,68.67 41.76,68.66 M_A2.2 ; 41.75,68.67 29.46,68.67 28.3,67.51 M_A1.2 28.32,65.73 28.32,56.48 26.94,55.11 M_A6.2 ; ESP32-D0WD-V3.19 38.39,1.71 39.12,0.98 v1(61.21,0.98)
  Bottom Layer w0.254: 68.69,55.11 69.19,55.61 M_A4.2 ; 68.69,55.11 M_A5.2 ; 68.69,55.11 69.22,54.58 69.22,5.94 64.26,0.98 v1(61.21,0.98)
TX2: length 200
  Top Layer w0.254: v1(45.97,9.75) 45.97,35.4 51.18,40.61 60.96,40.61 61.98,41.62 61.98,48.1 63.75,49.88 69.6,49.88 73.91,54.2 73.91,61.69 74.69,62.47 UART_5V2.2 ; v1(7.87,48.86) 7.84,48.86 UART_5V1.2 ; UART_9V1.2 7.87,63.66 v1(7.87,63.59) ; ESP32-D0WD-V3.18 33.31,3.18 32.13,2 10.41,2 v1(5.46,6.95)
  Bottom Layer w0.254: ESP32-D0WD-V3.18 33.31,5.85 35.05,7.59 43.81,7.59 v1(45.97,9.75) ; v1(7.87,63.59) v1(7.87,48.86) 7.83,48.81 v1(7.83,34.11) 5.19,34.11 2.92,31.84 2.92,9.49 v1(5.46,6.95)

## Copper pours and planes (outline as drawn; the poured copper is in the pictures)
GND on Top Layer: -4.7,76.93 105.16,76.93 105.16,-2.7 -4.7,-2.7
GND on Bottom Layer: -6.73,80.48 107.06,80.48 107.06,-6 -6.73,-6
GND on Inner1: -10.41,87.34 109.98,87.34 109.98,-11.72 -10.41,-11.72
GND on Inner2: -16.89,93.95 113.28,93.95 113.28,-15.53 -16.89,-15.53

Small or netless copper shapes (teardrops, artwork), in the pictures only: 93 on Top Layer, 65 on Bottom Layer, 10 on Inner1, 22 on Inner2
